# Altium project Business.PrjPcb
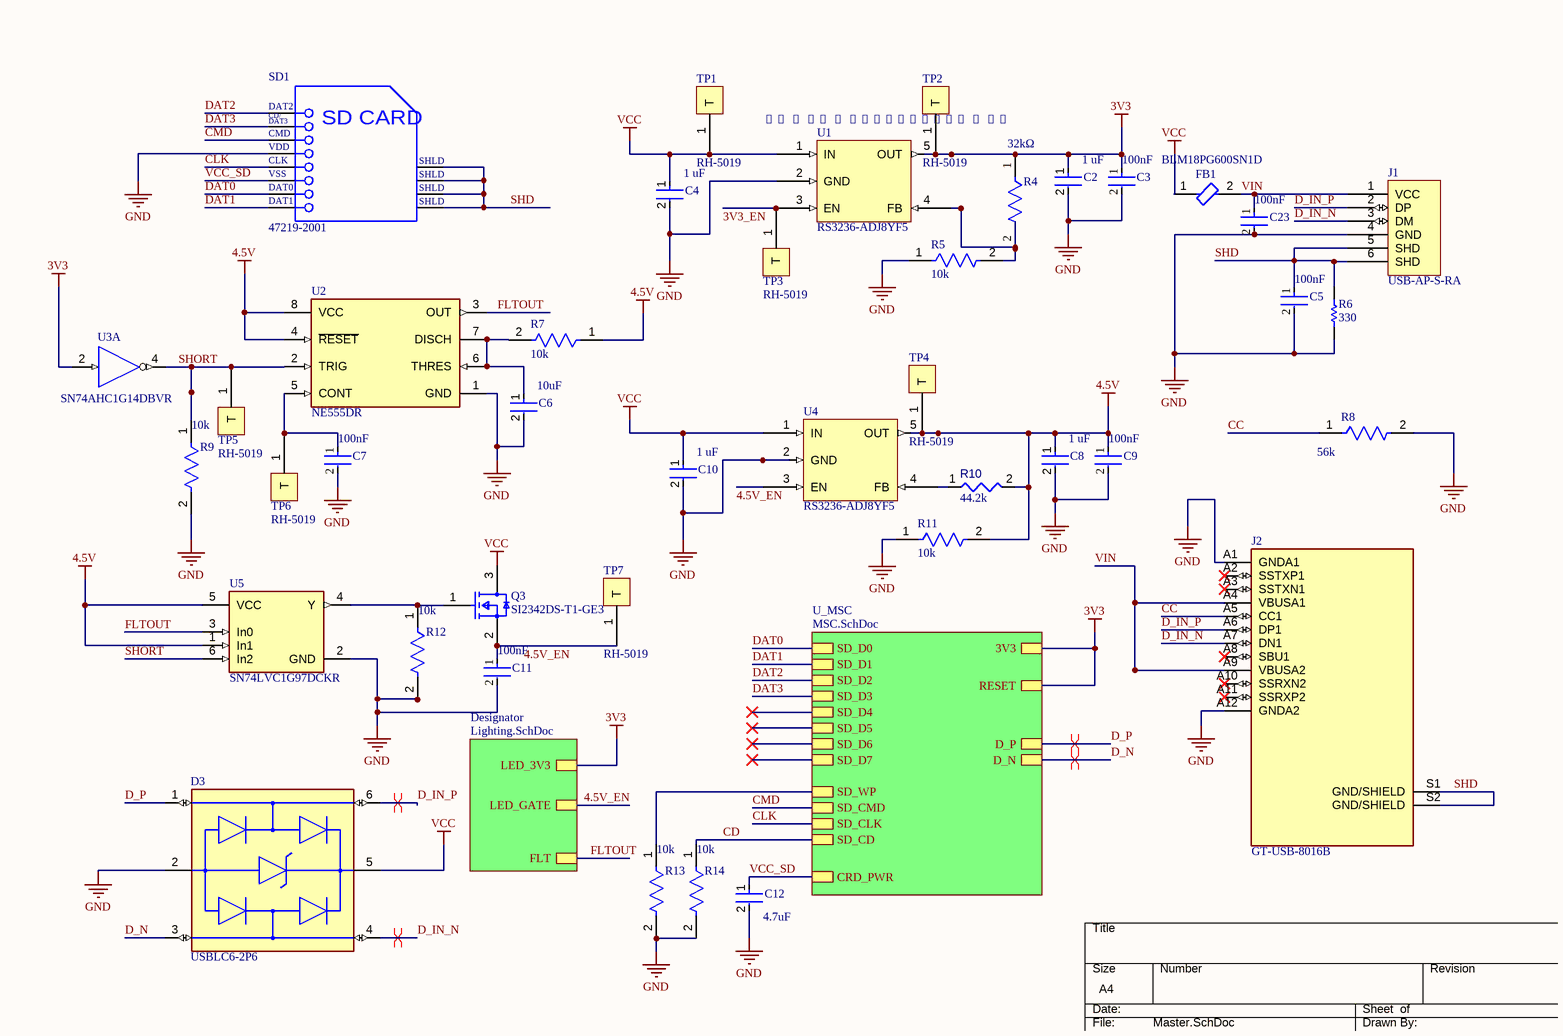
[diagram p0: Master.SchDoc]
3 sheets, 64 parts. Net scope: hierarchical (ports join the sheet entries above them; power ports are global).
Board files: USB.PcbDoc, USB_BITES.PcbDoc
Sheets:
  Master.SchDoc
    U_MSC = MSC.SchDoc
    Designator = Lighting.SchDoc

## Sheet Master.SchDoc
size A4; SheetNumber: 1; SheetTotal: 3

### Parts
C2  value 1 uF  [FP-CC0603-DA-MFG]  (hidden comment: CC0603KRX7R7BB105)
C3  Capacitance: 100nF  [FP-GRM155-0_05-MFG]  (hidden comment: GRM155R71C104KA88J)
C4  value 1 uF  [FP-CC0603-DA-MFG]  (hidden comment: CC0603KRX7R7BB105)
C5  Capacitance: 100nF  [FP-GRM155-0_05-MFG]  (hidden comment: GRM155R71C104KA88J)
C6  Capacitance: 10uF  [FP-GRM21B-0_1-MFG]  (hidden comment: GRM21BR61C106KE15K)
C7  Capacitance: 100nF  [FP-GRM155-0_05-MFG]  (hidden comment: GRM155R71C104KA88J)
C8  value 1 uF  [FP-CC0603-DA-MFG]  (hidden comment: CC0603KRX7R7BB105)
C9  Capacitance: 100nF  [FP-GRM155-0_05-MFG]  (hidden comment: GRM155R71C104KA88J)
C10  value 1 uF  [FP-CC0603-DA-MFG]  (hidden comment: CC0603KRX7R7BB105)
C11  Capacitance: 100nF  [FP-GRM155-0_05-MFG]  (hidden comment: GRM155R71C104KA88J)
C12  Capacitance: 4.7uF  [FP-CL21-IPC_A]  (hidden comment: CL21A475KAQNNNE)
C23  Capacitance: 100nF  [FP-GRM155-0_05-MFG]  (hidden comment: GRM155R71C104KA88J)
D3  USBLC6-2P6  [FP-SOT-666-MFG]
FB1  BLM18PG600SN1D  [FP-BLM18-0_15-t0_8-IPC_B]
J1  USB-AP-S-RA  [BELFUSE_SS-52400-002]
J2  GT-USB-8016B  [BELFUSE_SS-52400-002]
Q3  SI2342DS-T1-GE3  [FP-S-03946-MFG]
R4  Resistance: 32kΩ  [FP-RT0603-0_55-MFG]  (hidden comment: RT0603BRD0732KL)
R5  Resistance: 10k  [FP-RC0603-0_55-IPC_C]  (hidden comment: RC0603FR-0710KL)
R6  Resistance: 330  [RESC1608X55X25LL10T15]  (hidden comment: RC0603JR-07330RL)
R7  Resistance: 10k  [FP-RC0603-0_55-IPC_C]  (hidden comment: RC0603FR-0710KL)
R8  Resistance: 56k  [FP-RMCF1206-MFG]  (hidden comment: RMCF1206JT56K0)
R9  Resistance: 10k  [FP-RC0603-0_55-IPC_C]  (hidden comment: RC0603FR-0710KL)
R10  value 44.2k  [CAPC1608X06N]  (hidden comment: RC0603FR-0744K2L)
R11  Resistance: 10k  [FP-RC0603-0_55-IPC_C]  (hidden comment: RC0603FR-0710KL)
R12  Resistance: 10k  [FP-RC0603-0_55-IPC_C]  (hidden comment: RC0603FR-0710KL)
R13  Resistance: 10k  [FP-RC0603-0_55-IPC_C]  (hidden comment: RC0603FR-0710KL)
R14  Resistance: 10k  [FP-RC0603-0_55-IPC_C]  (hidden comment: RC0603FR-0710KL)
SD1  47219-2001  [MOLX-47219-2001-8_V]
TP1  RH-5019  [RH-5019-Footprint-1]
TP2  RH-5019  [RH-5019-Footprint-1]
TP3  RH-5019  [RH-5019-Footprint-1]
TP4  RH-5019  [RH-5019-Footprint-1]
TP5  RH-5019  [RH-5019-Footprint-1]
TP6  RH-5019  [RH-5019-Footprint-1]
TP7  RH-5019  [RH-5019-Footprint-1]
U1  RS3236-ADJ8YF5  [SOT95P245X110-5N]
U2  NE555DR  [FP-D0008A-IPC_A]
U3  SN74AHC1G14DBVR  [DBV0005A_L]  (part A of 2)
U4  RS3236-ADJ8YF5  [SOT95P245X110-5N]
U5  SN74LVC1G97DCKR  [FP-DCK0006A-MFG]

### Sub-sheets
Designator = Lighting.SchDoc: LED_3V3, LED_GATE, FLT
U_MSC = MSC.SchDoc: RESET, SD_D6, SD_D7, SD_D0, SD_D1, SD_WP, SD_D2, SD_D3, SD_D4, SD_CMD, SD_CLK, 3V3, SD_D5, CRD_PWR, SD_CD, D_N, D_P

### Nets
3V3: C2.1 C3.1 R4.1 TP2.1(T) U1.5(OUT) U3.2(A) ; sheet U_MSC/RESET, sheet U_MSC/3V3, sheet Designator/LED_3V3
4.5V: C8.1 C9.1 R7.1 R10.2 R11.2 TP4.1(T) U2.4(~{RESET}) U2.8(VCC) U4.5(OUT) U5.1(In1) U5.5(VCC)
GND: C2.2 C3.2 C4.2 C5.2 C6.2 C7.2 C8.2 C9.2 C10.2 C11.2 C12.2 C23.2 D3.2(GND) J1.4(GND) J2.A1(GNDA1) J2.A12(GNDA2) R5.1 R6.1 R8.2 R9.2 R11.1 R12.2 R13.2 R14.2 SD1.4(VDD) U1.2(GND) U2.1(GND) U4.2(GND) U5.2(GND)
VCC: C4.1 C10.1 D3.5(VBUS) FB1.1 Q3.3(D) TP1.1(T) U1.1(IN) U4.1(IN)
3V3_EN: TP3.1(T) U1.3(EN)
4.5V_EN: C11.1 Q3.2(S) TP7.1(T) U4.3(EN) ; sheet Designator/LED_GATE
CC: J2.A5(CC1) R8.1
CD: R14.1 ; sheet U_MSC/SD_CD
CLK: SD1.5(CLK) ; sheet U_MSC/SD_CLK
CMD: SD1.3(CMD) ; sheet U_MSC/SD_CMD
D_IN_N: D3.4(I/O2) J1.3(DM) J2.A7(DN1)
D_IN_P: D3.6(I/O1) J1.2(DP) J2.A6(DP1)
D_N: D3.3(I/O2) ; sheet U_MSC/D_N
D_P: D3.1(I/O1) ; sheet U_MSC/D_P
DAT0: SD1.7(DAT0) ; sheet U_MSC/SD_D0
DAT1: SD1.8(DAT1) ; sheet U_MSC/SD_D1
DAT2: SD1.1(DAT2) ; sheet U_MSC/SD_D2
DAT3: SD1.2(CD/DAT3) ; sheet U_MSC/SD_D3
FLTOUT: U2.3(OUT) U5.3(In0) ; sheet Designator/FLT
SHD: C5.1 J1.5(SHD) J1.6(SHD) J2.S1(GND/SHIELD) J2.S2(GND/SHIELD) R6.2 SD1.9(SHLD) SD1.10(SHLD) SD1.11(SHLD) SD1.12(SHLD)
SHORT: R9.1 TP5.1(T) U2.2(TRIG) U3.4(Y) U5.6(In2)
VCC_SD: C12.1 SD1.6(VSS) ; sheet U_MSC/CRD_PWR
VIN: C23.1 FB1.2 J1.1(VCC) J2.A4(VBUSA1) J2.A9(VBUSA2)
NetC6_1: C6.1 R7.2 U2.6(THRES) U2.7(DISCH)
NetC7_1: C7.1 TP6.1(T) U2.5(CONT)
NetQ3_1: Q3.1(G) R12.1 U5.4(Y)
NetR4_2: R4.2 R5.2 U1.4(FB)
NetR10_1: R10.1 U4.4(FB)
NetR13_1: R13.1 ; sheet U_MSC/SD_WP

Not connected (* = marked no-connect by the designer): J2 A2(SSTXP1)* A3(SSTXN1)* A8(SBU1)* A10(SSRXN2)* A11(SSRXP2)*

### Layout directives
differential pair: D_IN_N, D_IN_P, D_N, D_P

### Notes on the sheet
- 𝑅1 = 𝑅2 ∗ (VOUT/0.81 - 1)
- THIS DOCUMENT AND THE DATA DISCLOSED HEREIN OR
- HEREWITH IS THE PROPERTY OF ALTIUM LIMITED AND MAY
- DWG NO:
- REVISION
- REV:
- DESCRIPTION
- DATE
- APPROVED
- BE FREELY DISTRIBUTED IN WHOLE. NO RIGHTS ARE
- RESERVED OR EXPRESS OR IMPLIED WARANTEE GIVEN.
- ENG:
- APPROVALS
- PROJECT
- DSN:
- CHK:
- REFERENCE DOCUMENTS
- PROJECT REVISION:
- TITLE
- DOCUMENT REVISION:
- DESIGN ITEM:
- BOM:
- FAB DWG:
- PCB DWG:
- ASSY DWG:
- SCALE:
- A3
- SIZE
- CAGE CODE
- FILE NAME
- DWG NO.
- SHEET
- OF
- REV
- (in symbol CMP-2000-05245-1) CD/; DAT3; SD CARD

### Library data of the parts
C2 C4 C8 C10 = CMP-03422-000924-1: CAP CER 1UF 16V X7R 0603; Manufacturer: YAGEO; Tolerance: 0.1; Temperature Coefficient: 15%; Material: Ceramic; Package: CC0603-DA; RoHS: TRUE; Device Class L2: Capacitors; Temperature Characteristic: X7R; Temperature: -55°C to +125°C; Temperature Range Low: -55°C; Automotive: No; ComponentLink2Description: Datasheet; Lead Free: Yes; Capacitance: 1 uF; ComponentLink2URL: http://www.yageo.com/documents/recent/UPY-GPHC_X7R_6.3V-to-50V_18.pdf; Device Class L1: Passive Components; Voltage: 16 V; Octopart: https://octopart.com/cc0603krx7r7bb105-yageo-42271928; Category: Cap; Digikey Description: CAP CER 1UF 16V X7R 0603; Footprint Url: http://www.yageo.com/exep/pages/download/literatures/UPY-C_GEN_24.pdf; Height: 0.9mm; Manufacturer Part Number: CC0603KRX7R7BB105; Voltage Rating: 16 V; Temperature Range High: +125°C; Mouser Description: Multilayer Ceramic Capacitor, CC Series, 1 - F, - 10%, X7R, 16 V, 0603 [1608 Metric]; Device Class L3: Ceramic Capacitors
C3 C5 C7 C9 C11 C23 = CMP-2008-03928-2: NexarPartId: 9223238; Manufacturer Lifecycle Status: NRND; Voltage: 16V; Tolerance: 10%; Dielectric: X7R; Material: Ceramic; Schedule B: 8532240020, 8532240020; Mount: Surface Mount; Case/Package: 0402; Case Code (Imperial): 0402; Min Operating Temperature: -55°C; Length: 1mm; Voltage Rating (DC): 16V; Depth: 500µm; Lead Free: Lead Free; Max Operating Temperature: 125°C; Case Code (Metric): 1005; Radiation Hardening: No; Height: 550µm; Voltage Rating: 16V; Packaging: Cut Tape; RoHS: Compliant; Width: 500µm; Number of Pins: 2; REACH SVHC: No SVHC; Termination: SMD/SMT; Thickness: 500µm
C6 = CMP-2007-03534-2: Chip Multilayer Ceramic Capacitors for General Purpose, 0805, 10uF, X5R, 15%, 10%, 16V; Case Code (Imperial): 0805; Packaging: Tape and Reel; Width: 0.049inch; Depth: 1.25mm; Voltage Rating: 16V; Height: 1.25mm; Case/Package: 0805; Max Operating Temperature: 85°C; Min Operating Temperature: -55°C; Tolerance: 10%; Dielectric: X5R; REACH SVHC: No SVHC; Mount: Surface Mount; Radiation Hardening: No; Case Code (Metric): 2012; Length: 2mm; Package Quantity: 10000; Voltage Rating (DC): 16V; Voltage: 16V; Thickness: 0.053inch; Termination: SMD/SMT
C12 = CMP-13271-002624-1: CL21 Series 0805 4.7uF 25V ±10% Tolerance X5R Multilayer Ceramic Chip Capacitor; Case Code (Imperial): 0805; Thickness: 0.055inch; Mount: Surface Mount; Case Code (Metric): 2012; Depth: 1.25mm; Lead Free: Lead Free; Case/Package: 0805; Voltage Rating: 25V; Package Quantity: 1; Width: 0.049inch; Radiation Hardening: No; Voltage Rating (DC): 25V; Length: 2mm; Dielectric: X5R; Height: 1.25mm; Packaging: Tape and Reel; Tolerance: 10%; Min Operating Temperature: -55°C; Max Operating Temperature: 85°C
D3 = CMP-12225-000058-1: TVS DIODE 5.25V 17V SOT666; Min Breakdown Voltage: 6V; Power Line Protection: Yes; Element Configuration: Dual; Test Current: 1mA; Working Voltage: 5V; Number of Channels: 2; Max Reverse Leakage Current: 150nA; Direction: Unidirectional; Peak Pulse Current: 5A; Number of Elements: 1; Capacitance: 3.5pF; Max Breakdown Voltage: 6V; Height: 0.6mm; Depth: 1.3mm; Contact Plating: Tin; Reverse Breakdown Voltage: 6V; REACH SVHC: No SVHC; Operating Supply Voltage: 5V; Width: 1.3mm; Max Operating Temperature: 125°C; Reverse Standoff Voltage: 5V; ESD Protection: Yes; Package Quantity: 1; Termination: SMD/SMT; Length: 1.7mm; Leakage Current: 150nA; Number of Bidirectional Channels: 2; Case/Package: SOT-666; Min Operating Temperature: -40°C; Number of Pins: 6; Clamping Voltage: 17V; Breakdown Voltage: 6V; Lead Free: Lead Free; Radiation Hardening: No; Packaging: Tape and Reel; Mount: Surface Mount; Polarity: Unidirectional
FB1 = CMP-0686-00575-3: Chip Ferrite Bead, 0603, 60Ω @ 100MHz, 0.1Ω, , 1A; ESR (Equivalent Series Resistance): 60R; Number of Lines: 1; Material: Steel; Tolerance: 25%; Shielding: Unshielded; Current Rating: 500mA; Resistance: 100mR; Package Quantity: 1; Termination: SMD/SMT; Lead Free: Lead Free; Max Operating Temperature: 125°C; Number of Circuits: 1; Length: 1.6mm; Min Operating Temperature: -55°C; Case Code (Metric): 1608; Max DC Current: 500mA; REACH SVHC: No SVHC; Frequency: 100MHz; Number of Pins: 2; RoHS Compliant: Yes; Height: 0.8mm; Depth: 0.8mm; Width: 0.8mm; Test Frequency: 100MHz; Case/Package: 0603; Impedance: 60R; Max Current Rating: 500mA; Packaging: Tape and Reel; DC Resistance (DCR): 100mR; Case Code (Imperial): 0603; Core Material: Ferrite
J1 = CMP-002-00072-3: USB Type A Plug Single R/A PCB
J2 = CMP-002-00071-2: USB C 2.0 Plug
Q3 = CMP-02550-000018-1: MOSFET N-CH 8V 6A SOT-23; Manufacturer: Vishay; Number Of N Channels: 1; Pulse Drain Current: 30A; Reverse Recovery Charge: 17nC; Depletion Mode: False; Reverse Recovery Time: 40ns; Max Junction Temp: +150°C; Power Dissipation: 1.3W; Transconductance: 75S; Threshold Vgs Min: 0.35V; Turn Off Delay Time: 65ns; Rthja Max: 75°C/W; Input Capacitace At Vds: 1070pF @ 4V; Gate Charge At Vgs: 10.5nC @ 4.5V; Gate To Source Voltage: 5V; Turn On Delay Time: 6ns; Drain To Source Resistance: 0.014Ω; Typ Forward Diode Voltage: 0.82V; Standoff Height: 0.01mm; Max Forward Diode Voltage: 1.2V; Threshold Vgs Max: 0.8V; Continuous Drain Current: 6A; Device Class L1: Discrete Semiconductors; Mouser Description: MOSFET 8V 6A 2.5; Category: Trans; Digikey Description: MOSFET N-CH 8V 6A SOT-23; Manufacturer Part Number: SI2342DS-T1-GE3; Device Class L2: Transistors; Octopart: https://octopart.com/si2342ds-t1-ge3-vishay-45050957; ComponentLink2URL: https://www.vishay.com/docs/63302/si2342ds.pdf; RoHS: TRUE; Drain To Source Breakdown Voltage: 8V; Height: 1.12mm; Lead Free: Yes; Temperature Range Low: -55°C; Package: S-03946; Device Class L3: MOSFETs; Temperature Range High: +150°C; Ipc Land Pattern Name: SOT95P237X100-3; Drain To Source Voltage: 8V; Temperature: -55°C to +150°C; ComponentLink2Description: Datasheet; Number Of Channels: 1; Automotive: No
R4 = CMP-00621-34935746-1: RT0603BRD0732KL High Precision-High Stability Chip Resistor Thin Film 0603 32kOhm 0.1% Paper T/R; Temperature Coefficient: 25ppm/°C; Max Power Dissipation: 100mW; Case/Package: 0603; Composition: Thin Film; Features: Moisture Resistant; Packaging: Tape & Reel; RoHS: Compliant; Height: 558.8µm; Max Operating Temperature: 155°C; NexarPartId: 34935746; Number of Terminations: 2; Length: 1.6002mm; Width: 787.4µm; Tolerance: 0.1%; Min Operating Temperature: -55°C
R5 R7 R9 R11-R14 = CMP-2100-03664-2: RES 10K OHM 1% 1/10W 0603; Voltage Rating: 75V; Voltage Rating (DC): 50V; Power Rating: 100mW; Temperature Coefficient: 100ppm/°C; Depth: 0.8mm; Termination: SMD/SMT; Resistor Type: Thick Film; Series: RC; Construction: Rectangular; Features: Moisture Resistant; Packaging: Tape and Reel; Min Operating Temperature: -55°C; Number of Terminations: 2; Lead Pitch: 0.3mm; RoHS Compliant: Yes; Case/Package: 0603; Resistance Tolerance: 1%; Military Standard: Not; Weight: 7.1E-05oz; Number of Pins: 2; Tolerance: 1%; Length: 1.6mm; Case Code (Imperial): 0603; Lead Free: Lead Free; Width: 0.8mm; Max Power Dissipation: 100mW; Height: 0.45mm; Max Operating Temperature: 155°C; Case Code (Metric): 1608; Size Code: 0603
R6 = CMP-2000-06958-1: Chip Resistor, 330 Ohm, +/- 5%, 50 V, -55 to 155 degC, 0603 (1608 Metric), -40 to 155 degC, RoHS, Tape and Reel; Manufacturer: Yageo; Temperature Coefficient: ±100ppm/°C; Power Rating: 100mW; Voltage Rating: 50V; Product Range: RCSeries; SVHC: ToBeAdvised; Resistor Element Type: ThickFilm; Resistor Case Style: 0603[1608Metric]; Manufacturer URL: http://www.yageo.com/; Packaging: CutTape; Mounting Technology: SurfaceMount; Automotive Qualification Standard: -; MSL: MSL1-Unlimited; Datasheet URL: http://www.yageo.com/documents/recent/PYu-RC_Group_51_RoHS_L_7.pdf; Package Reference: 0603; Package Description: 2-Pin Surface Mount Device, Body 1.6 x 0.8 mm; Resistance Tolerance: ±5%; Datasheet Version: Rev. 7, 05/2017
R8 = CMP-26527-003341-1: 56kΩ ±5% 0.25W 1206 Thick Film Chip Resistor AEC-Q200 compliant; Max Power Dissipation: 250mW; Temperature Coefficient: 200ppm/°C; RoHS Compliant: Yes; Number of Terminations: 2; Max Operating Temperature: 155°C; Case/Package: 1206; Case Code (Imperial): 1206; Length: 0.126inch; Size Code: 1206; Height: 0.028inch; Resistor Type: Thick Film; Width: 0.063inch; Power Rating: 250mW; Contact Plating: Tin; Min Operating Temperature: -55°C; Features: Automotive AEC-Q200; Military Standard: Not; Mount: Surface Mount; Depth: 1.6mm; Tolerance: 5%; Lead Free: Lead Free; Packaging: Tape and Reel; Construction: Rectangular; Radiation Hardening: No; Case Code (Metric): 3216; Series: RMCF
R10 = CMP-009-00177-1: Fixed Resistor, Metal Glaze/thick Film, 0.1W, 44200ohm, 75V, 1% +/-Tol, 100ppm/Cel, Surface Mount, 0603; Power: 100mW; Min Operating Temperature: -55°C; Mounting Technology: Surface Mount; RoHS Compliant: Yes; Case/Package: 0603; Tolerance: 1%; Max Operating Temperature: 155°C; Pins: 2
SD1 = CMP-2000-05245-1: MicroSD Card Connector, Hinge Type, -40 to 85 degC, 8-Pin SMD, RoHS, Tape and Reel; Manufacturer: Molex; Current Rating: 500mA; Number of Contacts: 8; Pitch: 1.09mm; Insertion - Extraction Style: Hinged; Voltage Rating: 100VDC; Product: CardConnectors; Contact Material: CopperAlloy; Series: 47219; Packaging: Reel; Brand: Molex; Product Category: MemoryCardConnectors; Housing Material: Thermoplastic; Mounting Style: SMD/SMT; Termination Style: SMD; Datasheet Version: Rev. F, 06/2009; Card Type: microSD; Manufacturer URL: http://www.molex.com/; RoHS: Details; Datasheet URL: http://www.molex.com/pdm_docs/sd/472192001_sd.pdf; Factory Pack Quantity: 2400
TP1-TP7 = CMP-00030-00001-2: PC Test Point
U1 U4 = CMP-019-00049-2: IC Reg Lin Pos Adj 500MA SOT23-5
U2 = CMP-1685-00007-2: IC OSC SGL TIMER 100KHZ 8-SOIC; Low Level Output Current: 200mA; Quiescent Current: 15mA; Min Supply Voltage: 4.5V; Number of Timers/Counters: 1; Max Supply Voltage: 16V; Operating Supply Current: 10mA; High Level Output Current: -200mA; Packaging: Tape and Reel; Frequency: 100kHz; Weight: 0.002561oz; REACH SVHC: No SVHC; Package Quantity: 2500; Width: 3.91mm; Max Operating Temperature: 70°C; Contact Plating: Gold; Lead Free: Lead Free; Number of Pins: 8; Min Operating Temperature: 0°C; Radiation Hardening: No; Length: 4.9mm; Case/Package: SOIC; Height: 1.58mm; Mount: Surface Mount
U3 = CMP-2000-07131-1: Single Schmitt-Trigger Inverter Gate, 10.6 ns max, 2 to 5.5 V, -40 to 125 degC, 5-Pin SOT23 (DBV), Green (RoHS & no Sb/Br), Tape and Reel; Manufacturer: Texas Instruments; Supply Voltage Min: 2V; Logic IC Function: SingleInverterwithSchmittTrigger; No. of Pins: 5; Logic IC Family: AHC; Output Current: 8mA; Supply Voltage: 5.5V; Logic Function Number: 741G14; SVHC: NoSVHC(19-Dec-2012); No. of Gates: 1; Base Number: 74; Supply Voltage Range: 2Vto5.5V; Logic IC Base Number: 74114; Logic Case Style: SOT-23; Datasheet Version: Rev. Q, 09/2015; Mounting Technology: SurfaceMount; Termination Type: SMD; Operating Temperature Max: 85°C; IC Generic Number: 74AHC1G14; Operating Temperature Min: -40°C; No. of Inputs: 1; Supply Voltage Max: 5.5V; Datasheet URL: http://www.ti.com/lit/ds/symlink/sn74ahc1g14.pdf; Package Description: 5-Pin Small Outline Transistor, Body 2.9 x 1.6 mm, Pitch 0.95 mm; Operating Temperature Range: -40°Cto+85°C; Output Current Max: 8mA; Package URL: http://www.ti.com/lit/ml/mpds018l/mpds018l.pdf; Package Reference: DBV0005A; Logic Type: Inverter; Manufacturer URL: http://www.ti.com/; Package / Case: SOT-23
U5 = CMP-0859-00500-4: IC CONFIG MULT-FUNC GATE SC70-6; Manufacturer: Texas Instruments; Number Of Inputs: 3; Number Of Outputs: 1; Standoff Height: 0mm; Max Supply Voltage: 5.5V; Nominal Supply Current: 10uA; Propagation Delay: 6.1ps; Min Supply Voltage: 1.5V; Device Class L3: Logic Gates; Device Class L1: Integrated Circuits (ICs); Ambient Temperature Range High: +125°C; Ambient Temperature Range Low: -40°C; ComponentLink2Description: Datasheet; Octopart: https://octopart.com/sn74lvc1g97dckr-texas+instruments-464843; Category: IC; Digikey Description: IC CONFIG MULT-FUNC GATE SC70-6; Height: 1.1mm; Automotive: No; Lead Free: Yes; RoHS: TRUE; Temperature Range Low: -40°C; Number Of Circuits: 1; Device Class L2: Logic ICs; Manufacturer Part Number: SN74LVC1G97DCKR; Package: DCK0006A; ComponentLink2URL: http://www.ti.com/lit/ds/symlink/sn74lvc1g97.pdf; Mouser Description: Logic Gates CONFIGURABLE MULTI FUNCTN GATE; Temperature: -40°C to +125°C; Temperature Range High: +125°C

## Sheet MSC.SchDoc: MSC
size A4; Revision: Rev A; SheetNumber: 2; SheetTotal: 3
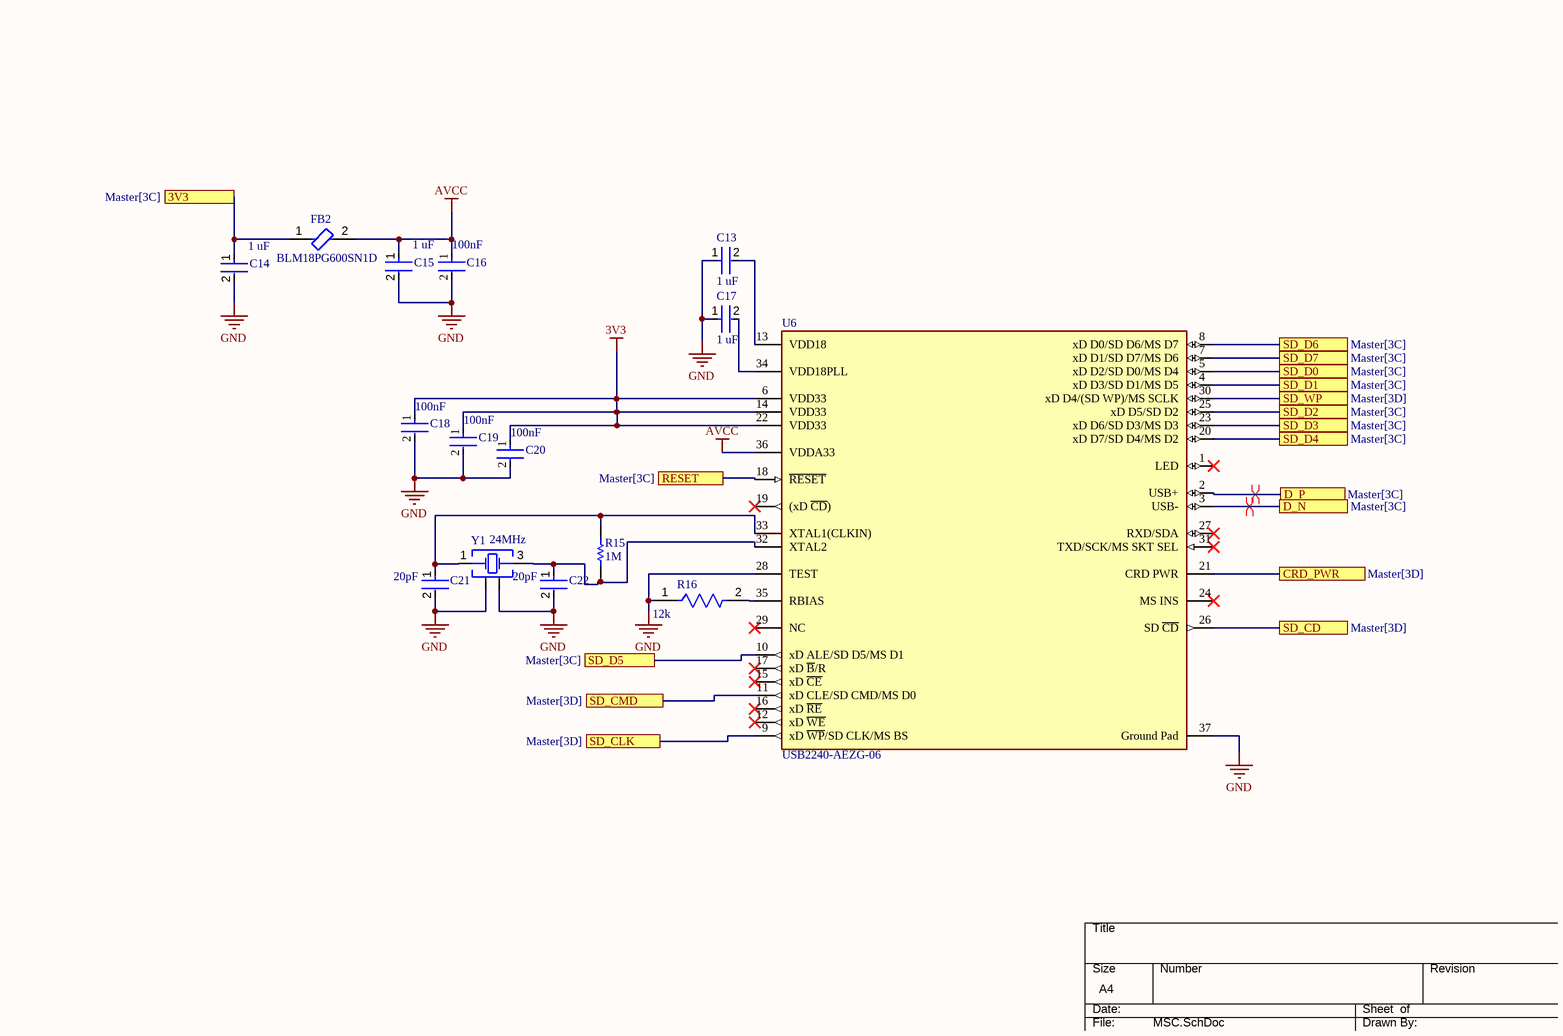
[diagram p1: MSC.SchDoc]

### Parts
C13  value 1 uF  [FP-CC0603-DA-MFG]  (hidden comment: CC0603KRX7R7BB105)
C14  value 1 uF  [FP-CC0603-DA-MFG]  (hidden comment: CC0603KRX7R7BB105)
C15  value 1 uF  [FP-CC0603-DA-MFG]  (hidden comment: CC0603KRX7R7BB105)
C16  Capacitance: 100nF  [FP-GRM155-0_05-MFG]  (hidden comment: GRM155R71C104KA88J)
C17  value 1 uF  [FP-CC0603-DA-MFG]  (hidden comment: CC0603KRX7R7BB105)
C18  Capacitance: 100nF  [FP-GRM155-0_05-MFG]  (hidden comment: GRM155R71C104KA88J)
C19  Capacitance: 100nF  [FP-GRM155-0_05-MFG]  (hidden comment: GRM155R71C104KA88J)
C20  Capacitance: 100nF  [FP-GRM155-0_05-MFG]  (hidden comment: GRM155R71C104KA88J)
C21  value 20pF  [FP-GJM033-0_03-IPC_A]  (hidden comment: GJM0335C1E200FB01D)
C22  value 20pF  [FP-GJM033-0_03-IPC_A]  (hidden comment: GJM0335C1E200FB01D)
FB2  BLM18PG600SN1D  [FP-BLM18-0_15-t0_8-IPC_B]
R15  1M  [RESC1608X55X25LL10T15]
R16  Resistance: 12k  [FP-RMCF0603-IPC_C]  (hidden comment: RMCF0603FT12K0)
U6  USB2240-AEZG-06  [FP-36QFN-4106-6x6B-MFG]
Y1  Frequency: 24MHz  [WE-XTAL_CFPX-180]  (hidden comment: 830035266)

### Ports
3V3 (see Master[3C]), CRD_PWR (see Master[3D]), D_N (see Master[3C]), D_P (see Master[3C]), RESET (see Master[3C]), SD_CD (see Master[3D]), SD_CLK (see Master[3D]), SD_CMD (see Master[3D]), SD_D0 (see Master[3C]), SD_D1 (see Master[3C]), SD_D2 (see Master[3C]), SD_D3 (see Master[3C]), SD_D4 (see Master[3C]), SD_D5 (see Master[3C]), SD_D6 (see Master[3C]), SD_D7 (see Master[3C]), SD_WP (see Master[3D])

### Nets
3V3: C14.1 C18.1 C19.1 C20.1 FB2.1 U6.6(VDD33) U6.14(VDD33) U6.18(~{RESET}) U6.22(VDD33) ; port RESET, port 3V3
AVCC: C15.1 C16.1 FB2.2 U6.36(VDDA33)
GND: C13.1 C14.2 C15.2 C16.2 C17.1 C18.2 C19.2 C20.2 C21.2 C22.2 R16.1 U6.28(TEST) U6.37(Ground_Pad) Y1.2(GND&Lid) Y1.4(GND&Lid)
CD: U6.26(SD_~{CD}) ; port SD_CD
CLK: U6.9(xD_~{WP}/SD_CLK/MS_BS) ; port SD_CLK
CMD: U6.11(xD_CLE/SD_CMD/MS_D0) ; port SD_CMD
D_N: U6.3(USB-) ; port D_N
D_P: U6.2(USB+) ; port D_P
DAT0: U6.5(xD_D2/SD_D0/MS_D4) ; port SD_D0
DAT1: U6.4(xD_D3/SD_D1/MS_D5) ; port SD_D1
DAT2: U6.25(xD_D5/SD_D2) ; port SD_D2
DAT3: U6.23(xD_D6/SD_D3/MS_D3) ; port SD_D3
VCC_SD: U6.21(CRD_PWR) ; port CRD_PWR
NetC13_2: C13.2 U6.13(VDD18)
NetC17_2: C17.2 U6.34(VDD18PLL)
NetC21_1: C21.1 R15.1 U6.33(XTAL1(CLKIN)) Y1.1(Crystal)
NetC22_1: C22.1 R15.2 U6.32(XTAL2) Y1.3(Crystal)
NetR13_1: U6.30(xD_D4/(SD_WP)/MS_SCLK) ; port SD_WP
NetR16_2: R16.2 U6.35(RBIAS)
NetU6_7: U6.7(xD_D1/SD_D7/MS_D6) ; port SD_D7
NetU6_8: U6.8(xD_D0/SD_D6/MS_D7) ; port SD_D6
NetU6_10: U6.10(xD_ALE/SD_D5/MS_D1) ; port SD_D5
NetU6_20: U6.20(xD_D7/SD_D4/MS_D2) ; port SD_D4

Not connected (* = marked no-connect by the designer): U6 1(LED)* 12(xD_~{WE})* 15(xD_~{CE})* 16(xD_~{RE})* 17(xD_~{B}/R)* 19((xD_~{CD}))* 24(MS_INS)* 27(RXD/SDA)* 29(NC)* 31(TXD/SCK/MS_SKT_SEL)*

### Layout directives
differential pair: D_N, D_P

### Notes on the sheet
- THIS DOCUMENT AND THE DATA DISCLOSED HEREIN OR
- HEREWITH IS THE PROPERTY OF ALTIUM LIMITED AND MAY
- DWG NO:
- REVISION
- REV:
- DESCRIPTION
- DATE
- APPROVED
- BE FREELY DISTRIBUTED IN WHOLE. NO RIGHTS ARE
- RESERVED OR EXPRESS OR IMPLIED WARANTEE GIVEN.
- ENG:
- APPROVALS
- PROJECT
- DSN:
- CHK:
- REFERENCE DOCUMENTS
- PROJECT REVISION:
- TITLE
- DOCUMENT REVISION:
- DESIGN ITEM:
- BOM:
- FAB DWG:
- PCB DWG:
- ASSY DWG:
- SCALE:
- A3
- SIZE
- CAGE CODE
- FILE NAME
- DWG NO.
- SHEET
- OF
- REV

### Library data of the parts
C13-C15 C17 = CMP-03422-000924-1: as C2 on sheet Master; Package: CC0603-DA; RoHS: TRUE; Device Class L2: Capacitors; Temperature Characteristic: X7R; Temperature: -55°C to +125°C; Temperature Range Low: -55°C; Automotive: No; ComponentLink2Description: Datasheet; Lead Free: Yes; Capacitance: 1 uF; ComponentLink2URL: http://www.yageo.com/documents/recent/UPY-GPHC_X7R_6.3V-to-50V_18.pdf; Device Class L1: Passive Components; Voltage: 16 V; Octopart: https://octopart.com/cc0603krx7r7bb105-yageo-42271928; Category: Cap; Digikey Description: CAP CER 1UF 16V X7R 0603; Footprint Url: http://www.yageo.com/exep/pages/download/literatures/UPY-C_GEN_24.pdf; Height: 0.9mm; Manufacturer Part Number: CC0603KRX7R7BB105; Voltage Rating: 16 V; Temperature Range High: +125°C; Mouser Description: Multilayer Ceramic Capacitor, CC Series, 1 - F, - 10%, X7R, 16 V, 0603 [1608 Metric]; Device Class L3: Ceramic Capacitors
C16 C18-C20 = CMP-2008-03928-2: as C3 on sheet Master; Schedule B: 8532240020, 8532240020; Mount: Surface Mount; Case/Package: 0402; Case Code (Imperial): 0402; Min Operating Temperature: -55°C; Length: 1mm; Voltage Rating (DC): 16V; Depth: 500µm; Lead Free: Lead Free; Max Operating Temperature: 125°C; Case Code (Metric): 1005; Radiation Hardening: No; Height: 550µm; Voltage Rating: 16V; Packaging: Cut Tape; RoHS: Compliant; Width: 500µm; Number of Pins: 2; REACH SVHC: No SVHC; Termination: SMD/SMT; Thickness: 500µm
C21 C22 = CMP-06035-050874-1: Ceramic Capacitor 20pF ±1% 25V C0G 0201 (0603 Metric)
FB2 = CMP-0686-00575-3: as FB1 on sheet Master; Package Quantity: 1; Termination: SMD/SMT; Lead Free: Lead Free; Max Operating Temperature: 125°C; Number of Circuits: 1; Length: 1.6mm; Min Operating Temperature: -55°C; Case Code (Metric): 1608; Max DC Current: 500mA; REACH SVHC: No SVHC; Frequency: 100MHz; Number of Pins: 2; RoHS Compliant: Yes; Height: 0.8mm; Depth: 0.8mm; Width: 0.8mm; Test Frequency: 100MHz; Case/Package: 0603; Impedance: 60R; Max Current Rating: 500mA; Packaging: Tape and Reel; DC Resistance (DCR): 100mR; Case Code (Imperial): 0603; Core Material: Ferrite
R15 = CMP-1659-00056-1: Chip Resistor, 1 MOhm, +/- 1%, 100 mW, -55 to 155 degC, 0603 (1608 Metric), RoHS, Tape and Reel; Voltage Rating (DC): 25 V; Tolerance: 20%; Case\Package: Radial; Capacitance: 1 mF; Min Operating Temperature: -40 degC; PackageDescription: 2-Pin Surface Mount Device, Body 1.6 x 0.8 mm; ComponentLink1Description: Manufacturer URL; Radiation Hardening: No; DatasheetVersion: Rev. 4, 02/2016; REACH SVHC: No SVHC; Length: 20 mm; Max Operating Temperature: 85 degC; Diameter: 10 mm; Packaging: Bulk; Package Quantity: 200; PackageReference: 0603; Mount: Through Hole; ComponentLink1URL: http://www.yageo.com/; ComponentLink2URL: http://www.yageo.com/documents/recent/PYu-RC_Group_51_RoHS_L_04.pdf; ComponentLink2Description: Datasheet; Width: 0 inch; Lead Pitch: 5 mm; RoHSCompliant: true; Voltage Rating: 25 V; Height: 20 mm
R16 = CMP-26527-001326-1: 12kΩ ±1% 0.1W 0603 Thick Film Chip Resistor AEC-Q200 compliant; Temperature Coefficient: 100ppm/°C; Max Power Dissipation: 100mW; Lead Free: Lead Free; Case Code (Metric): 1608; Features: Automotive AEC-Q200; Length: 0.061inch; Radiation Hardening: No; Size Code: 0603; Mount: Surface Mount; Series: RMCF; Width: 0.031inch; Tolerance: 1%; Case Code (Imperial): 0603; Case/Package: 0603; Resistor Type: Thick Film; Min Operating Temperature: -55°C; Packaging: Tape and Reel; Height: 0.022inch; Contact Plating: Tin; Number of Terminations: 2; RoHS Compliant: Yes; Power Rating: 100mW; Max Operating Temperature: 155°C
U6 = CMP-06284-000093-1: IC INTERFACE SPECIALIZED 36QFN; Manufacturer: Murata; Manufacturer Part Number: GRM188R71H104KA93D; Operating Supply Current: 135mA; Max Supply Voltage: 3.6V; Data Rate: 35Mbps; Operating Supply Voltage: 3.3V; Number of Transceivers: 1; Min Supply Voltage: 3V; Interface: SPI; Dielectric Material: Ceramic; Value: 100nF; Multilayer: Yes; Tolerance  (fill in as +-): 10%; Rated DC Voltage (URdc): 50V; Temperature Characteristics Code: X7R; Length: 6.15mm; Width: 6.15mm; Lead Free: Lead Free; Number of Pins: 36; Series: -; Case/Package: QFN; RoHS Compliant: Yes; Packaging: Tray; Mount: Surface Mount; Package Quantity: 490; Min Operating Temperature: 0°C; Height: 0.95mm; Max Operating Temperature: 70°C; Reach SVHC Compliant: Yes; Supplier: Arrow Electronics; Supplier Part Number: GRM188R71H104KA93D; RoHS: Yes; Category: Ceramic Capacitors; Stock: 200000; Pricing: 8000=0.0106, 12000=0.0105, 20000=0.0104, 24000=0.0103, 100000=0.0096 (USD); Mounting Technology: Surface Mount; Pins: 2; Package Shape: Rectangular; Terminal Finish: Nickel; JESD-609 Code: e3; Capacitor Type: Ceramic; Package Style: SMTMeter; Tolerance (fill in as +-): 10%; Termination: Wraparound; ComponentLink1URL: https://datasheet.ciiva.com:443/pdfs/VipMasterIC/IC/MURE/MURE-S-A0004386736/MURE-S-A0004388063-1.pdf?src-supplier=IHS+Markit; ComponentLink1Description: https://datasheet.ciiva.com:443/pdfs/VipMasterIC/IC/MURE/MURE-S-A0004386736/MURE-S-A0004388063-1.pdf?src-supplier=IHS+Markit; ComponentLink2URL: https://datasheet.ciiva.com/11786/0900766b807a1cab-11786047.pdf?src-supplier=Rs; ComponentLink2Description: https://datasheet.ciiva.com/11786/0900766b807a1cab-11786047.pdf?src-supplier=Rs; ComponentLink3URL: https://datasheet.ciiva.com/19467/1857604-19467681.pdf?src-supplier=Jameco; ComponentLink3Description: https://datasheet.ciiva.com/19467/1857604-19467681.pdf?src-supplier=Jameco; ComponentLink4URL: https://datasheet.ciiva.com/29201/451744-da-01-en-vs-kondensator-0603-29201904.pdf?src-supplier=Conrad; ComponentLink4Description: https://datasheet.ciiva.com/29201/451744-da-01-en-vs-kondensator-0603-29201904.pdf?src-supplier=Conrad; ComponentLink5URL: https://datasheet.ciiva.com/131/partnumbering-e-01-131738.pdf?src-supplier=Digikey; ComponentLink5Description: https://datasheet.ciiva.com/131/partnumbering-e-01-131738.pdf?src-supplier=Digikey; ComponentLink6URL: https://datasheet.ciiva.com/131/partnumbering-e-01-131739.pdf?src-supplier=Digikey; ComponentLink6Description: https://datasheet.ciiva.com/131/partnumbering-e-01-131739.pdf?src-supplier=Digikey; ComponentLink7URL: https://datasheet.ciiva.com/131/partnumbering-e-01-131740.pdf?src-supplier=Digikey; ComponentLink7Description: https://datasheet.ciiva.com/131/partnumbering-e-01-131740.pdf?src-supplier=Digikey; ComponentLink8URL: https://datasheet.ciiva.com/14116/nmgrm-data-en-14116602.pdf?src-supplier=Distrelec; ComponentLink8Description: https://datasheet.ciiva.com/14116/nmgrm-data-en-14116602.pdf?src-supplier=Distrelec; ComponentLink9URL: https://datasheet.ciiva.com/48436/nmgrm-data-en-48436667.pdf?src-supplier=Distrelec; ComponentLink9Description: https://datasheet.ciiva.com/48436/nmgrm-data-en-48436667.pdf?src-supplier=Distrelec; ComponentLink10URL: https://datasheet.ciiva.com/28534/4360-28534245.pdf?src-supplier=Element14; ComponentLink10Description: https://datasheet.ciiva.com/28534/4360-28534245.pdf?src-supplier=Element14; ComponentLink11URL: https://datasheet.ciiva.com/7937/1747470-7937658.pdf?src-supplier=Element14; ComponentLink11Description: https://datasheet.ciiva.com/7937/1747470-7937658.pdf?src-supplier=Element14; ComponentLink12URL: https://datasheet.ciiva.com/7937/4360-7937659.pdf?src-supplier=Element14; ComponentLink12Description: https://datasheet.ciiva.com/7937/4360-7937659.pdf?src-supplier=Element14; ComponentLink13URL: https://datasheet.ciiva.com:443/pdfs/VipMasterIC/IC/KEME/KEME-S-A0008991665/KEME-S-A0008991665-1.pdf?src-supplier=IHS+Markit; ComponentLink13Description: https://datasheet.ciiva.com:443/pdfs/VipMasterIC/IC/KEME/KEME-S-A0008991665/KEME-S-A0008991665-1.pdf?src-supplier=IHS+Markit
Y1 = CMP-03913-116876455-1: 830035266 WE-XTAL Quartz Crystal; Length: 3.2mm; NexarPartId: 116876455; Width: 2.5mm; Height: 800µm; Max Operating Temperature: 60°C; Min Operating Temperature: -10°C

## Sheet Lighting.SchDoc
size A; SheetNumber: 3; SheetTotal: 3
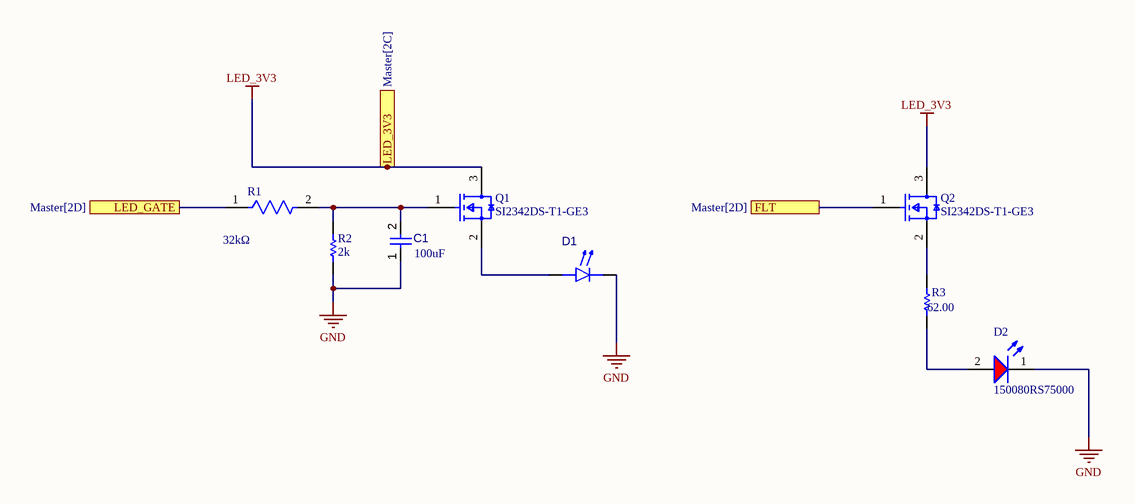
[diagram p2: Lighting.SchDoc]

### Parts
C1  value 100uF  [CAPC3216X19N]  (hidden comment: GRM31CR60J107KEA8L)
D1  HL-AM-2835H489W-S1-08HL-HR3  [HL-AM-2835H489W-S1-08HL-HR3-Footprint-1]  (value not drawn)
D2  150080RS75000  [WL-SMCW_0805_150080xx75000]
Q1  SI2342DS-T1-GE3  [FP-S-03946-MFG]
Q2  SI2342DS-T1-GE3  [FP-S-03946-MFG]
R1  Resistance: 32kΩ  [FP-RT0603-0_55-MFG]  (hidden comment: RT0603BRD0732KL)
R2  2k  [RESC1608X55X30ML15T15]
R3  value 62.00  [RESC1206(3216)_N]  (hidden comment: 62R 1% 1206(3216))

### Ports
FLT (see Master[2D]), LED_3V3 (see Master[2C]), LED_GATE (see Master[2D])

### Nets
GND: C1.1 D1.1(K) D2.1(K) R2.1
LED_3V3: Q1.3(D) Q2.3(D) ; port LED_3V3  [project net 3V3]
4.5V_EN: R1.1 ; port LED_GATE
FLTOUT: Q2.1(G) ; port FLT
NetC1_2: C1.2 Q1.1(G) R1.2 R2.2
NetD1_2: D1.2(A) Q1.2(S)
NetD2_2: D2.2(A) R3.2
NetQ2_2: Q2.2(S) R3.1

### Library data of the parts
C1 = CMP-001-00083-1: 6.3V 100uF X5R ¡À10% 1206 Multilayer Ceramic Capacitors MLCC - SMD/SMT ROHS
D1 = CMP-007-00036-1
D2 = CMP-1426-00011-3: LED Uni-Color Red 630nm 2-Pin Chip 0805(2012Metric) T/R; Viewing Angle: 140°; Max Junction Temperature (Tj): 95°C; Power Dissipation: 72mW; Forward Current: 100mA; Forward Voltage: 2V; Wavelength: 625nm; Test Current: 20mA; Max Reverse Voltage (DC): 5V; Luminous Intensity: 150mcd; Lens Style: Clear, Rectangular; REACH SVHC: Unknown; Height: 700µm; Case Code (Metric): 2012; Peak Wavelength: 630nm; Length: 2mm; Width: 1.25mm; RoHS: Compliant; Packaging: Tape and Reel; Dominant Wavelength: 625nm; Color: Red; Case Code (Imperial): 0805; Min Operating Temperature: -40°C; Mount: Surface Mount; Max Operating Temperature: 85°C; Case/Package: 0805
Q1 Q2 = CMP-02550-000018-1: as Q3 on sheet Master; Continuous Drain Current: 6A; Device Class L1: Discrete Semiconductors; Mouser Description: MOSFET 8V 6A 2.5; Category: Trans; Digikey Description: MOSFET N-CH 8V 6A SOT-23; Manufacturer Part Number: SI2342DS-T1-GE3; Device Class L2: Transistors; Octopart: https://octopart.com/si2342ds-t1-ge3-vishay-45050957; ComponentLink2URL: https://www.vishay.com/docs/63302/si2342ds.pdf; RoHS: TRUE; Drain To Source Breakdown Voltage: 8V; Height: 1.12mm; Lead Free: Yes; Temperature Range Low: -55°C; Package: S-03946; Device Class L3: MOSFETs; Temperature Range High: +150°C; Ipc Land Pattern Name: SOT95P237X100-3; Drain To Source Voltage: 8V; Temperature: -55°C to +150°C; ComponentLink2Description: Datasheet; Number Of Channels: 1; Automotive: No
R1 = CMP-00621-34935746-1: as R4 on sheet Master; Case/Package: 0603; Composition: Thin Film; Features: Moisture Resistant; Packaging: Tape & Reel; RoHS: Compliant; Height: 558.8µm; Max Operating Temperature: 155°C; NexarPartId: 34935746; Number of Terminations: 2; Length: 1.6002mm; Width: 787.4µm; Tolerance: 0.1%; Min Operating Temperature: -55°C
R2 = CMP-2000-00317-1: Part Number: ERJ-3EKF2001V; Manufacturer: Panasonic
R3 = CMP-1014-00373-1: 62R 0.25W 1% 1206 (3216 Metric)  SMD; Case-Metric: 3216; Case-EIA: 1206; Power: 0.25 W; Technology: SMT; Tolerance: 1 %

## Nets that join several sheets
3V3: Master (6 pins), MSC (9 pins), Lighting (Q1.3 Q2.3)
GND: Master (29 pins), MSC (15 pins), Lighting (C1.1 D1.1 D2.1 R2.1)
4.5V_EN: Master (C11.1 Q3.2 TP7.1 U4.3), Lighting (R1.1)
CD: Master (R14.1), MSC (U6.26)
CLK: Master (SD1.5), MSC (U6.9)
CMD: Master (SD1.3), MSC (U6.11)
D_N: Master (D3.3), MSC (U6.3)
D_P: Master (D3.1), MSC (U6.2)
DAT0: Master (SD1.7), MSC (U6.5)
DAT1: Master (SD1.8), MSC (U6.4)
DAT2: Master (SD1.1), MSC (U6.25)
DAT3: Master (SD1.2), MSC (U6.23)
FLTOUT: Master (U2.3 U5.3), Lighting (Q2.1)
NetR13_1: Master (R13.1), MSC (U6.30)
VCC_SD: Master (C12.1 SD1.6), MSC (U6.21)